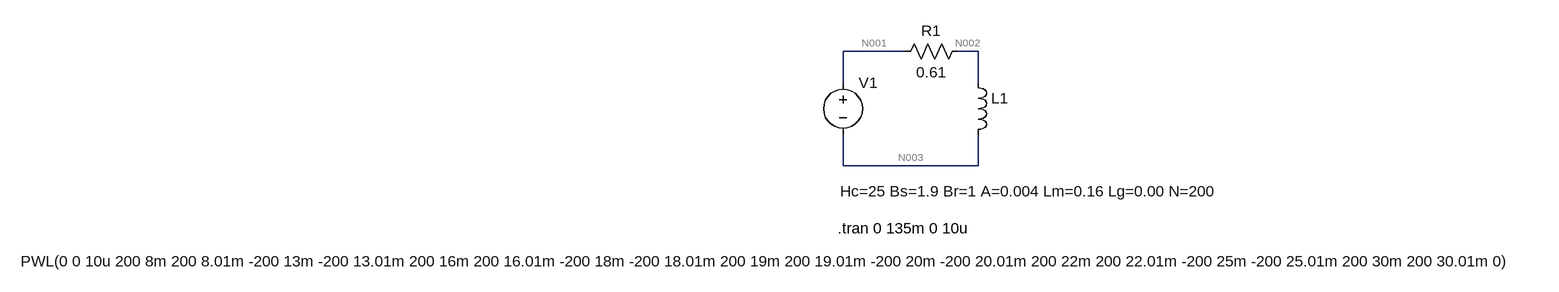
[diagram p0: schematic PWL.asc]
PWL.asc, the LTspice schematic file:
Version 4.1
SHEET 1 3432 680
WIRE 432 -96 336 -96
WIRE 544 -96 512 -96
WIRE 336 -48 336 -96
WIRE 544 -48 544 -96
WIRE 336 80 336 32
WIRE 544 80 544 32
WIRE 544 80 336 80
SYMBOL res 528 -112 R90
WINDOW 0 0 56 VBottom 2
WINDOW 3 32 56 VTop 2
SYMATTR InstName R1
SYMATTR Value 0.61
SYMBOL ind 528 -64 R0
WINDOW 3 -196 183 Left 2
SYMATTR Value Hc=25 Bs=1.9 Br=1 A=0.004 Lm=0.16 Lg=0.00 N=200
SYMATTR InstName L1
SYMATTR SpiceLine Rser=0 Rpar=1T Cpar=0
SYMBOL voltage 336 -64 R0
WINDOW 3 -1265 291 Left 2
SYMATTR InstName V1
SYMATTR Value PWL(0 0 10u 200 8m 200 8.01m -200 13m -200 13.01m 200 16m 200 16.01m -200 18m -200 18.01m 200 19m 200 19.01m -200 20m -200 20.01m 200 22m 200 22.01m -200 25m -200 25.01m 200 30m 200 30.01m 0)
TEXT 328 176 Left 2 !.tran 0 135m 0 10u

The netlist it stands for:
* PWL.asc
R1 N002 N001 0.61
L1 N002 N003 Hc=25 Bs=1.9 Br=1 A=0.004 Lm=0.16 Lg=0.00 N=200 Rser=0 Rpar=1T Cpar=0
V1 N001 N003 PWL(0 0 10u 200 8m 200 8.01m -200 13m -200 13.01m 200 16m 200 16.01m -200 18m -200 18.01m 200 19m 200 19.01m -200 20m -200 20.01m 200 22m 200 22.01m -200 25m -200 25.01m 200 30m 200 30.01m 0)
.tran 0 135m 0 10u
.backanno
.end

* Results of the author's LTspice run, read from the files saved beside the schematic
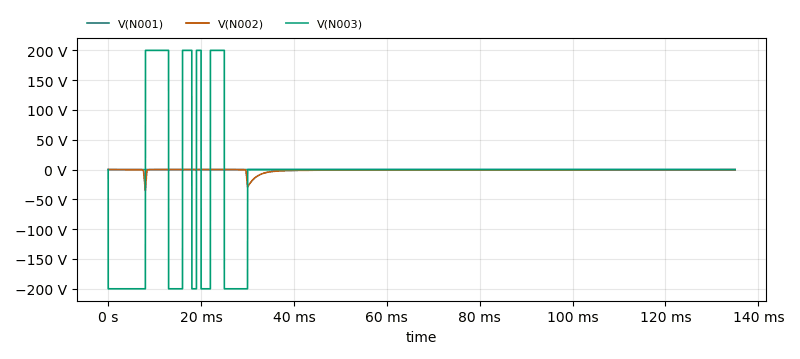
[diagram p1: Transient Analysis of PWL.asc, plotted from the saved traces]
* Transient Analysis, 1 run:
*   V(N001): min -8.897 mV, max 5.47 mV, average -20.21 µV, rms 415.7 µV, last 17.75 µV
*   V(N002): min -34.98 V, max 5.304 mV, average -995.3 mV, rms 3.203 V, last -280.4 mV
*   V(N003): min -200 V, max 200 V, average -11.85 V, rms 94.23 V, last 0 V